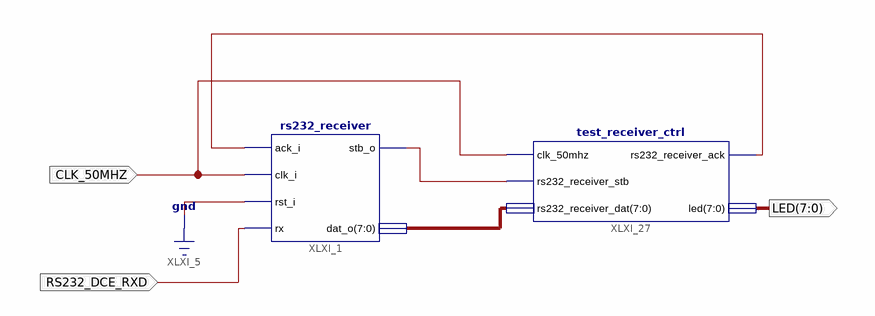
[diagram p0: schematic sheet 1]
// Xilinx ISE schematic test_receiver.sch (spartan3e) as structural Verilog: 2 symbols, 3 ports
module test_receiver (
  input  RS232_DCE_RXD,
  input  CLK_50MHZ,
  output [7:0] LED
);

  wire SW0, XLXN_65;
  wire [7:0] XLXN_66;

  rs232_receiver XLXI_1 (
    .ack_i(SW0), .clk_i(CLK_50MHZ), .rst_i(1'b0), .rx(RS232_DCE_RXD), .stb_o(XLXN_65), .dat_o(XLXN_66));
  test_receiver_ctrl XLXI_27 (
    .clk_50mhz(CLK_50MHZ), .rs232_receiver_stb(XLXN_65), .rs232_receiver_dat(XLXN_66),
    .rs232_receiver_ack(SW0), .led(LED));
endmodule
